# EAGLE design TDA2003-Amplifier-Stereo (EAGLE 7.2.0)
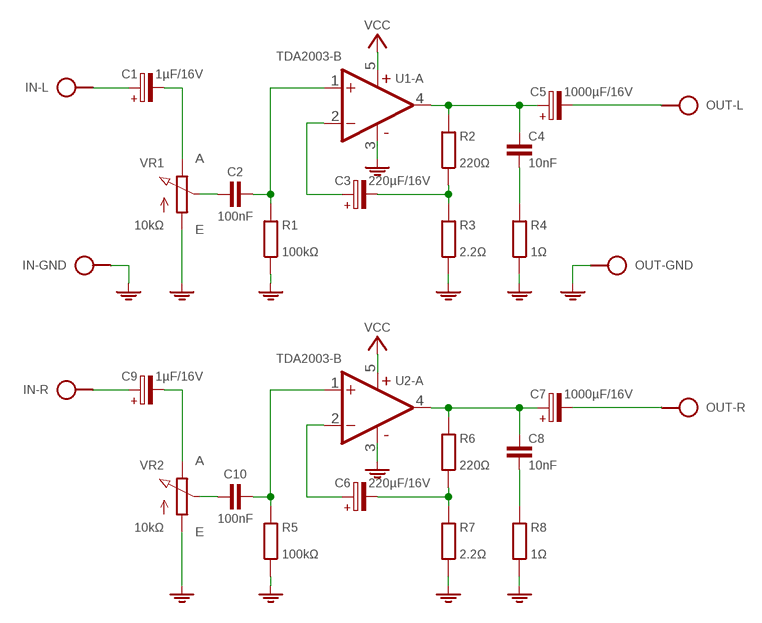
[diagram p0: schematic, sheet 1]

## Parts
C1  1µF/16V  CPOL-HE2,5-4  [E2,5-4]
C2  100nF  C-H050-020X044/V  [C050-020X044/V]
C3  220µF/16V  CPOL-HE5-5  [E5-5]
C4  10nF  C050-025X075/V  [C050-025X075/V]
C5  1000µF/16V  CPOL-HE5-5  [E5-5]
C6  220µF/16V  CPOL-HE5-5  [E5-5]
C7  1000µF/16V  CPOL-HE5-5  [E5-5]
C8  10nF  C050-025X075/V  [C050-025X075/V]
C9  1µF/16V  CPOL-HE2,5-4  [E2,5-4]
C10  100nF  C-H050-020X044/V  [C050-020X044/V]
IN  SAUDIO  [SPAD-3]
OUT  SAUDIO  [SPAD-3]
PWR  VCC_GNDL  [SPAD-+]
PWR1  VCC_GNDL  [SPAD-+]
R1  100kΩ  R0204/10-V  [0204/10-V]
R2  220Ω  R0204/10-V  [0204/10-V]
R3  2.2Ω  R0204/10-V  [0204/10-V]
R4  1Ω  R0204/10-V  [0204/10-V]
R5  100kΩ  R0204/10-V  [0204/10-V]
R6  220Ω  R0204/10-V  [0204/10-V]
R7  2.2Ω  R0204/10-V  [0204/10-V]
R8  1Ω  R0204/10-V  [0204/10-V]
U1  TDA2003-B  [TO220-B5]
U2  TDA2003-B  [TO220-B5]
VR1  10kΩ  POT-3P  [CONN-3P]
VR2  10kΩ  POT-3P  [CONN-3P]

## Nets
AOUT: C4.1 C5.+ R2.1 U1.4(-A:OUT)
AOUT1: C7.+ C8.1 R6.1 U2.4(-A:OUT)
FB: C3.- R2.2 R3.1
FB1: C6.- R6.2 R7.1
GND: IN.2 OUT.2 PWR1.1 PWR.1 R1.2 R3.2 R4.2 R5.2 R7.2 R8.2 U1.3(-B:V-) U2.3(-B:V-) VR1.1(A) VR2.1(A)
IN+: C2.2 R1.1 U1.1(-A:+IN)
IN+1: C10.2 R5.1 U2.1(-A:+IN)
IN-: C3.+ U1.2(-A:-IN)
IN-1: C6.+ U2.2(-A:-IN)
N$1: C4.2 R4.1
N$2: C2.1 VR1.2(S)
N$3: C1.- VR1.3(E)
N$4: C1.+ IN.1
N$5: C8.2 R8.1
N$6: C9.- VR2.3(E)
N$7: C10.1 VR2.2(S)
N$8: C9.+ IN.3
OUT: C5.- OUT.1
OUT1: C7.- OUT.3
VCC: PWR1.2 PWR.2 U1.5(-B:V+) U2.5(-B:V+)

## Library data of the parts
C1 C3 C5-C7 C9 = c:CPOL-H
C2 C10 = c:C-H
C4 C8 = c:C: CAPACITOR, European symbol
IN OUT = pad:SAUDIO
PWR PWR1 = pad:VCC_GND
R1-R8 = r:R: RESISTOR, European symbol
U1 U2 = ic:TDA2003
VR1 VR2 = r:POT

## Board
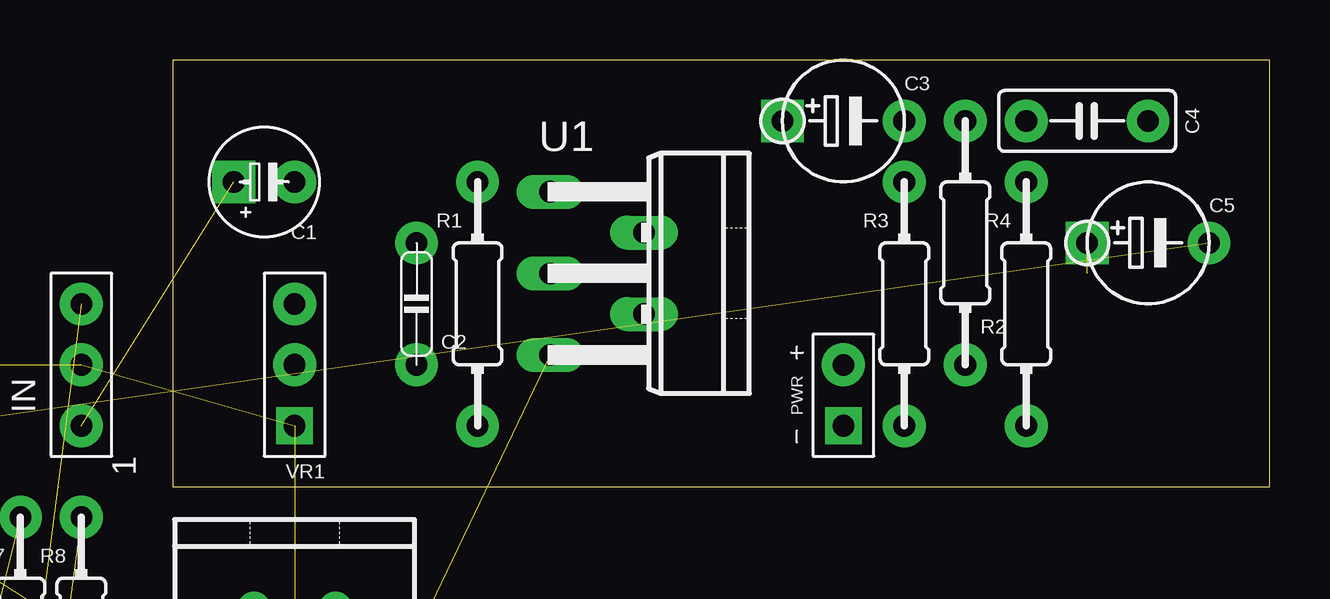
[diagram p1: board, top side]
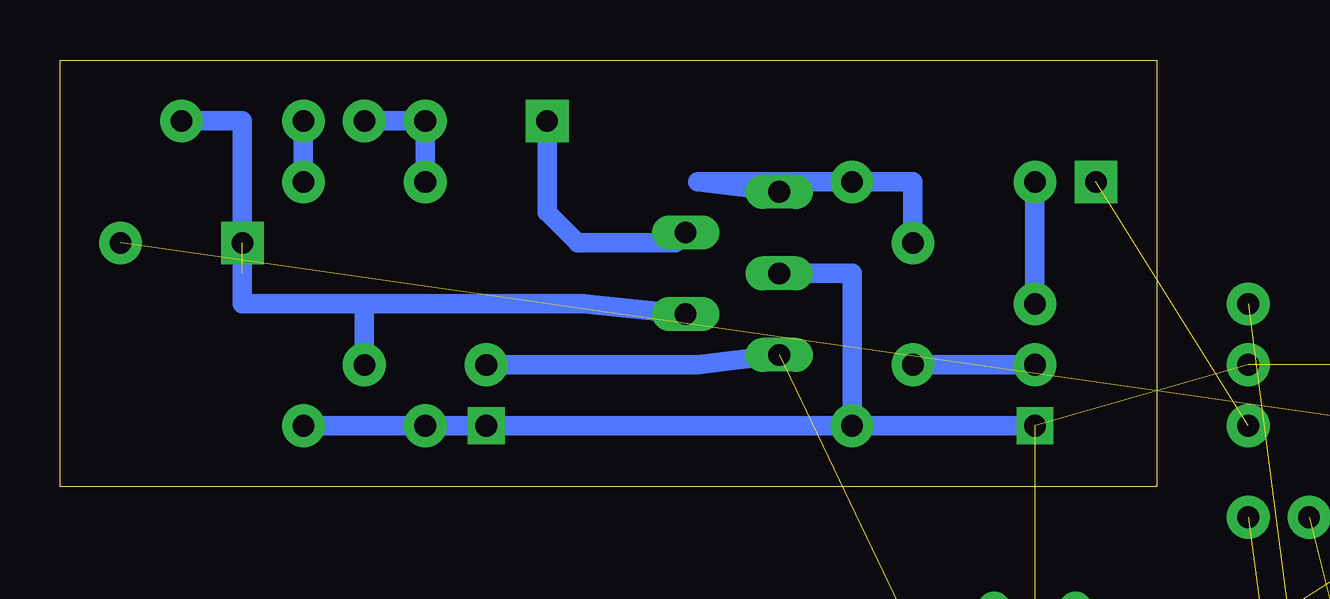
[diagram p2: board, bottom side, seen from below]

Size 45.7 x 17.78 mm. Coordinates in mm from the lower left corner, seen from the top.
Outline: 0,0 45.7,0 45.7,17.78 0,17.78 0,0
Copper layers (1*16): Top 0.035mm / dielectric 1.5mm / Bottom 0.035mm
Design rules "default": minimum track width 10mil, minimum drill 24mil, track to track 8mil, track to pad 8mil, pad to pad 8mil, via to via 8mil, smd to smd 8mil, copper to edge 40mil, drill to drill 8mil, minimum pad ring 10mil, minimum via ring 8mil, stop-mask expansion 4mil, vias tented up to drill 0mil, thermal gap 10mil

### Footprints (pad centres in the part's own frame; a part is rotated, then mirrored left to right if it is on the bottom)
E2,5-4 = drill 0.9 pad 1.778 square: + 1.27,0 | drill 0.9 pad 1.778: - -1.27,0
C050-020X044/V = drill 0.9 pad 1.778: 1 0,2.54; 2 0,-2.54
E5-5 = drill 0.9 pad 1.778 square: + -2.54,0 | drill 0.9 pad 1.778: - 2.54,0
C050-025X075/V = drill 0.9 pad 1.778: 1 0,2.54; 2 0,-2.54
SPAD-3 = drill 0.9 pad 1.778: 1 0,-2.54; 2 0,0; 3 0,2.54
SPAD-+ = drill 0.9 pad 1.524 square: 1 0,-1.27 | drill 0.9 pad 1.778: 2 0,1.27
0204/10-V = drill 0.9 pad 1.778: 1 0,5.08; 2 0,-5.08
TO220-B5 = drill 0.9 long: 1 -3.4,-8.4; 2 -1.7,-4.5; 3 0,-8.4; 4 1.7,-4.5; 5 3.4,-8.4
CONN-3P = drill 0.9 pad 1.524 square: 1 0,2.54 | drill 0.9 pad 1.778: 2 0,0; 3 0,-2.54

### Placement (x,y rotation side)
C1  3.81,12.7 180 top
C2  10.16,7.62 180 top
C3  27.94,15.24 0 top
C4  38.1,15.24 270 top
C5  40.64,10.16 0 top
C6  0,-25.4 0 top  (outside the outline)
C7  -8.89,-25.4 0 top  (outside the outline)
C8  -6.35,-17.78 0 top  (outside the outline)
C9  -10.16,-31.75 0 top  (outside the outline)
C10  3.81,-16.51 0 top  (outside the outline)
IN  -3.81,5.08 0 top  (outside the outline)
OUT  -10.16,5.08 0 top  (outside the outline)
PWR  27.94,3.81 0 top
PWR1  7.62,-25.4 0 top  (outside the outline)
R1  12.7,7.62 0 top
R2  33.02,10.16 180 top
R3  30.48,7.62 0 top
R4  35.56,7.62 0 top
R5  -11.43,-6.35 0 top  (outside the outline)
R6  -8.89,-6.35 0 top  (outside the outline)
R7  -6.35,-6.35 0 top  (outside the outline)
R8  -3.81,-6.35 0 top  (outside the outline)
U1  24.13,8.89 270 top
U2  5.08,-1.27 0 top  (outside the outline)
VR1  5.08,5.08 180 top
VR2  -10.16,-17.78 0 top  (outside the outline)

### Tracks (layer width: path | path; a pad name or v marks a point on that pad's centre or on a via)
AOUT  (1 unrouted)
  Bottom 0.813: R2.1 33.02,7.62 | 33.02,7.62 23.87,7.62 U1.4 | 33.02,7.62 38.1,7.62 C5.+ 38.1,15.24 C4.1
AOUT1  (3 unrouted)
FB
  Bottom 0.813: R2.2 C3.- R3.1
FB1  (2 unrouted)
GND  (8 unrouted)
  Bottom 0.813: R1.2 VR1.1 | R1.2 12.7,8.89 U1.3 | R1.2 PWR.1 29.21,2.54 R3.2 R4.2
IN+
  Bottom 0.813: C2.2 10.16,12.7 R1.1 19.13,12.7 U1.1
IN+1  (2 unrouted)
IN-
  Bottom 0.813: C3.+ 25.4,11.43 24.13,10.16 20.06,10.16 U1.2
IN-1  (1 unrouted)
N$1
  Bottom 0.813: C4.2 R4.1
N$2
  Bottom 0.813: VR1.2 C2.1
N$3
  Bottom 0.813: C1.- VR1.3
N$4  (1 unrouted)
N$5  (1 unrouted)
N$6  (1 unrouted)
N$7  (1 unrouted)
N$8  (1 unrouted)
OUT  (1 unrouted)
OUT1  (1 unrouted)
VCC  (2 unrouted)
  Bottom 0.813: PWR.2 19.13,5.08 U1.5